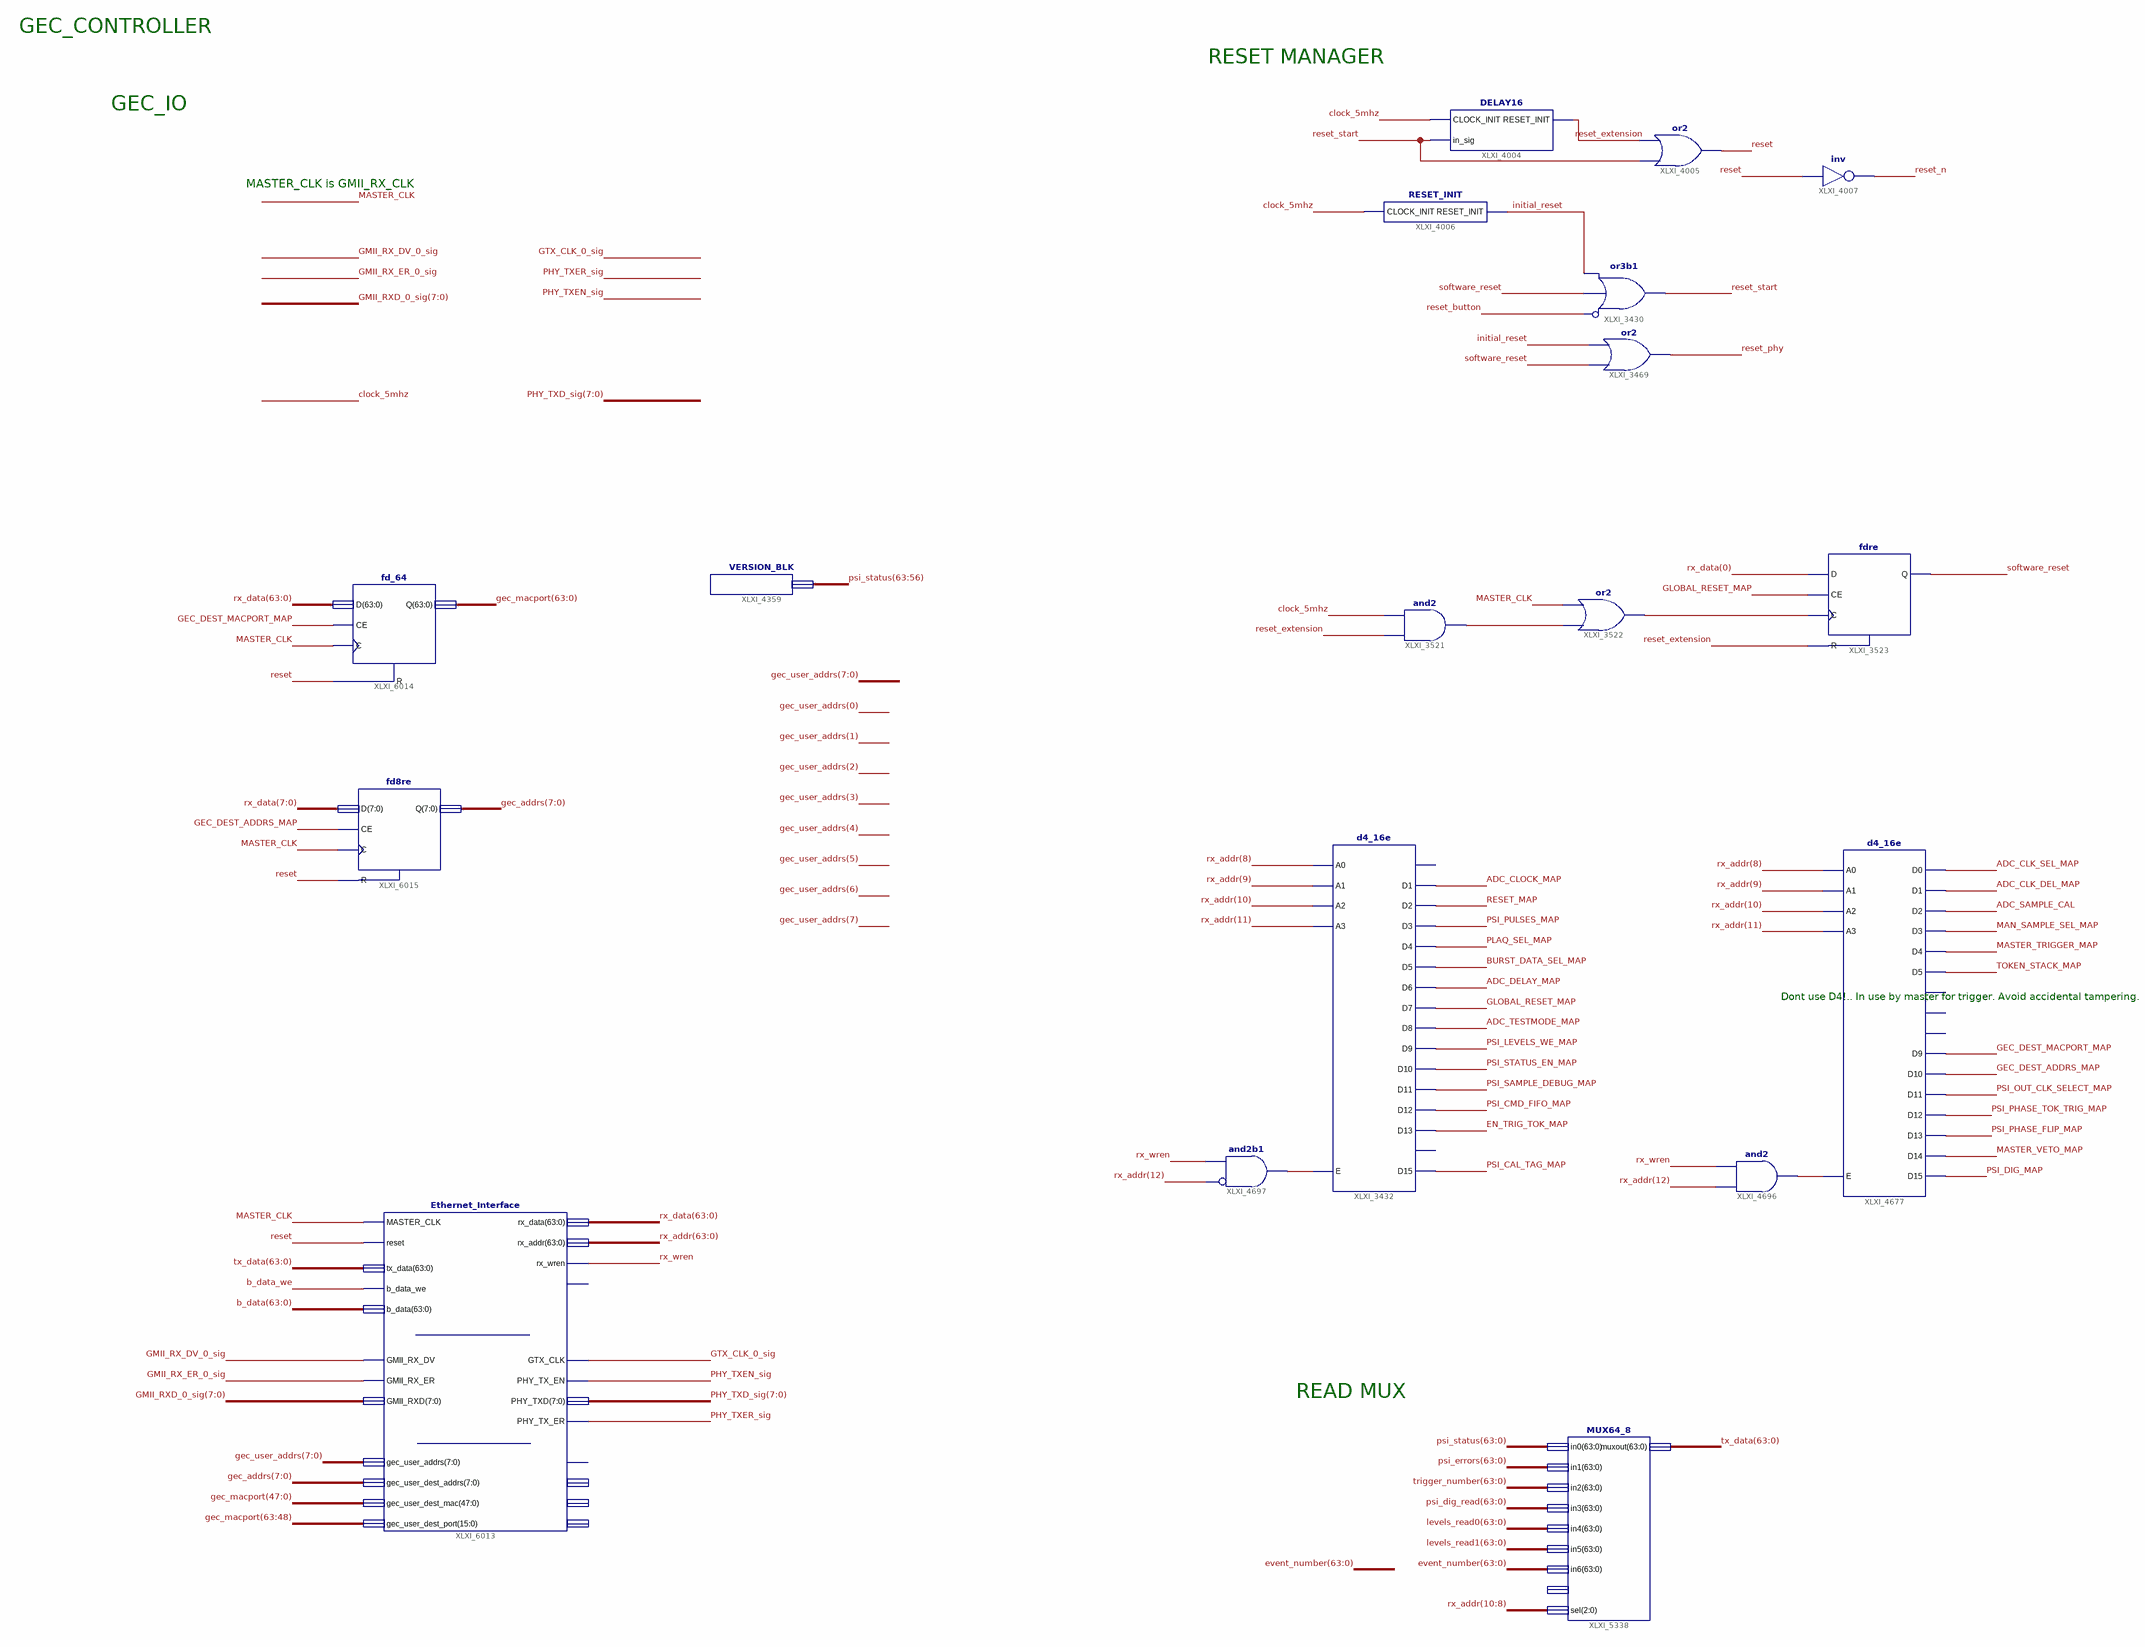
[diagram p0: schematic sheet 1]
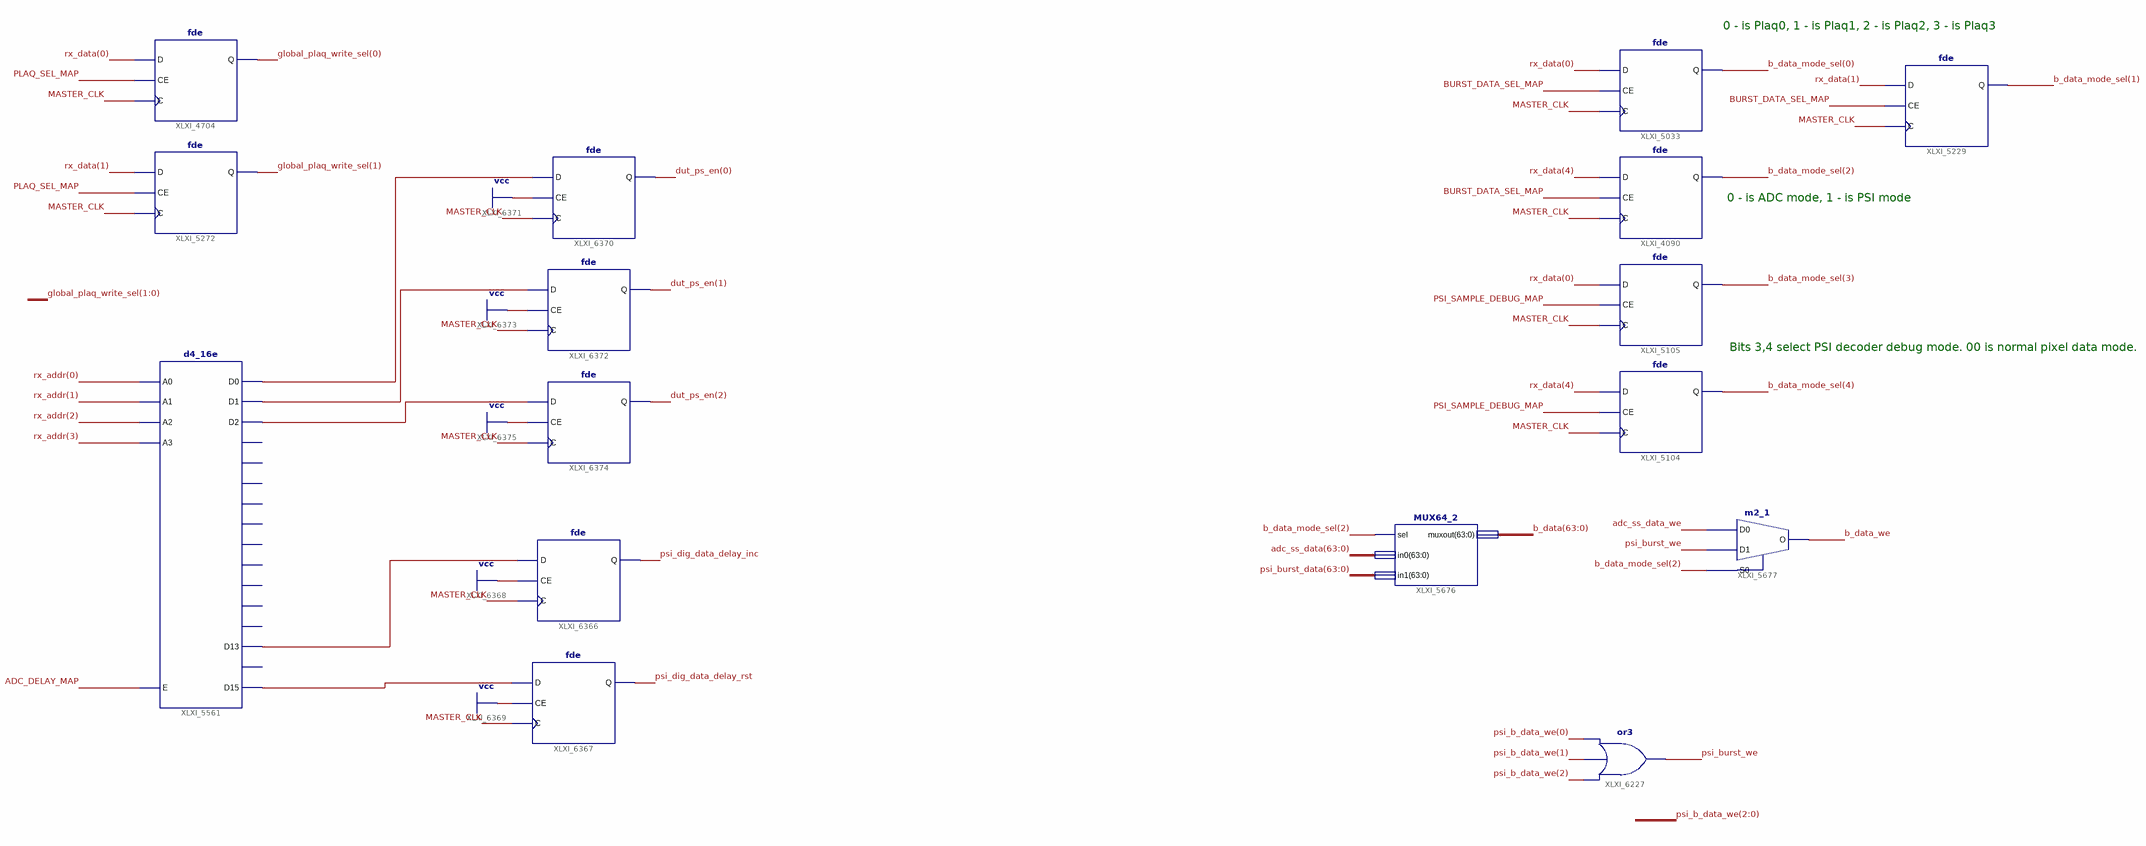
[diagram p1: schematic sheet 2]
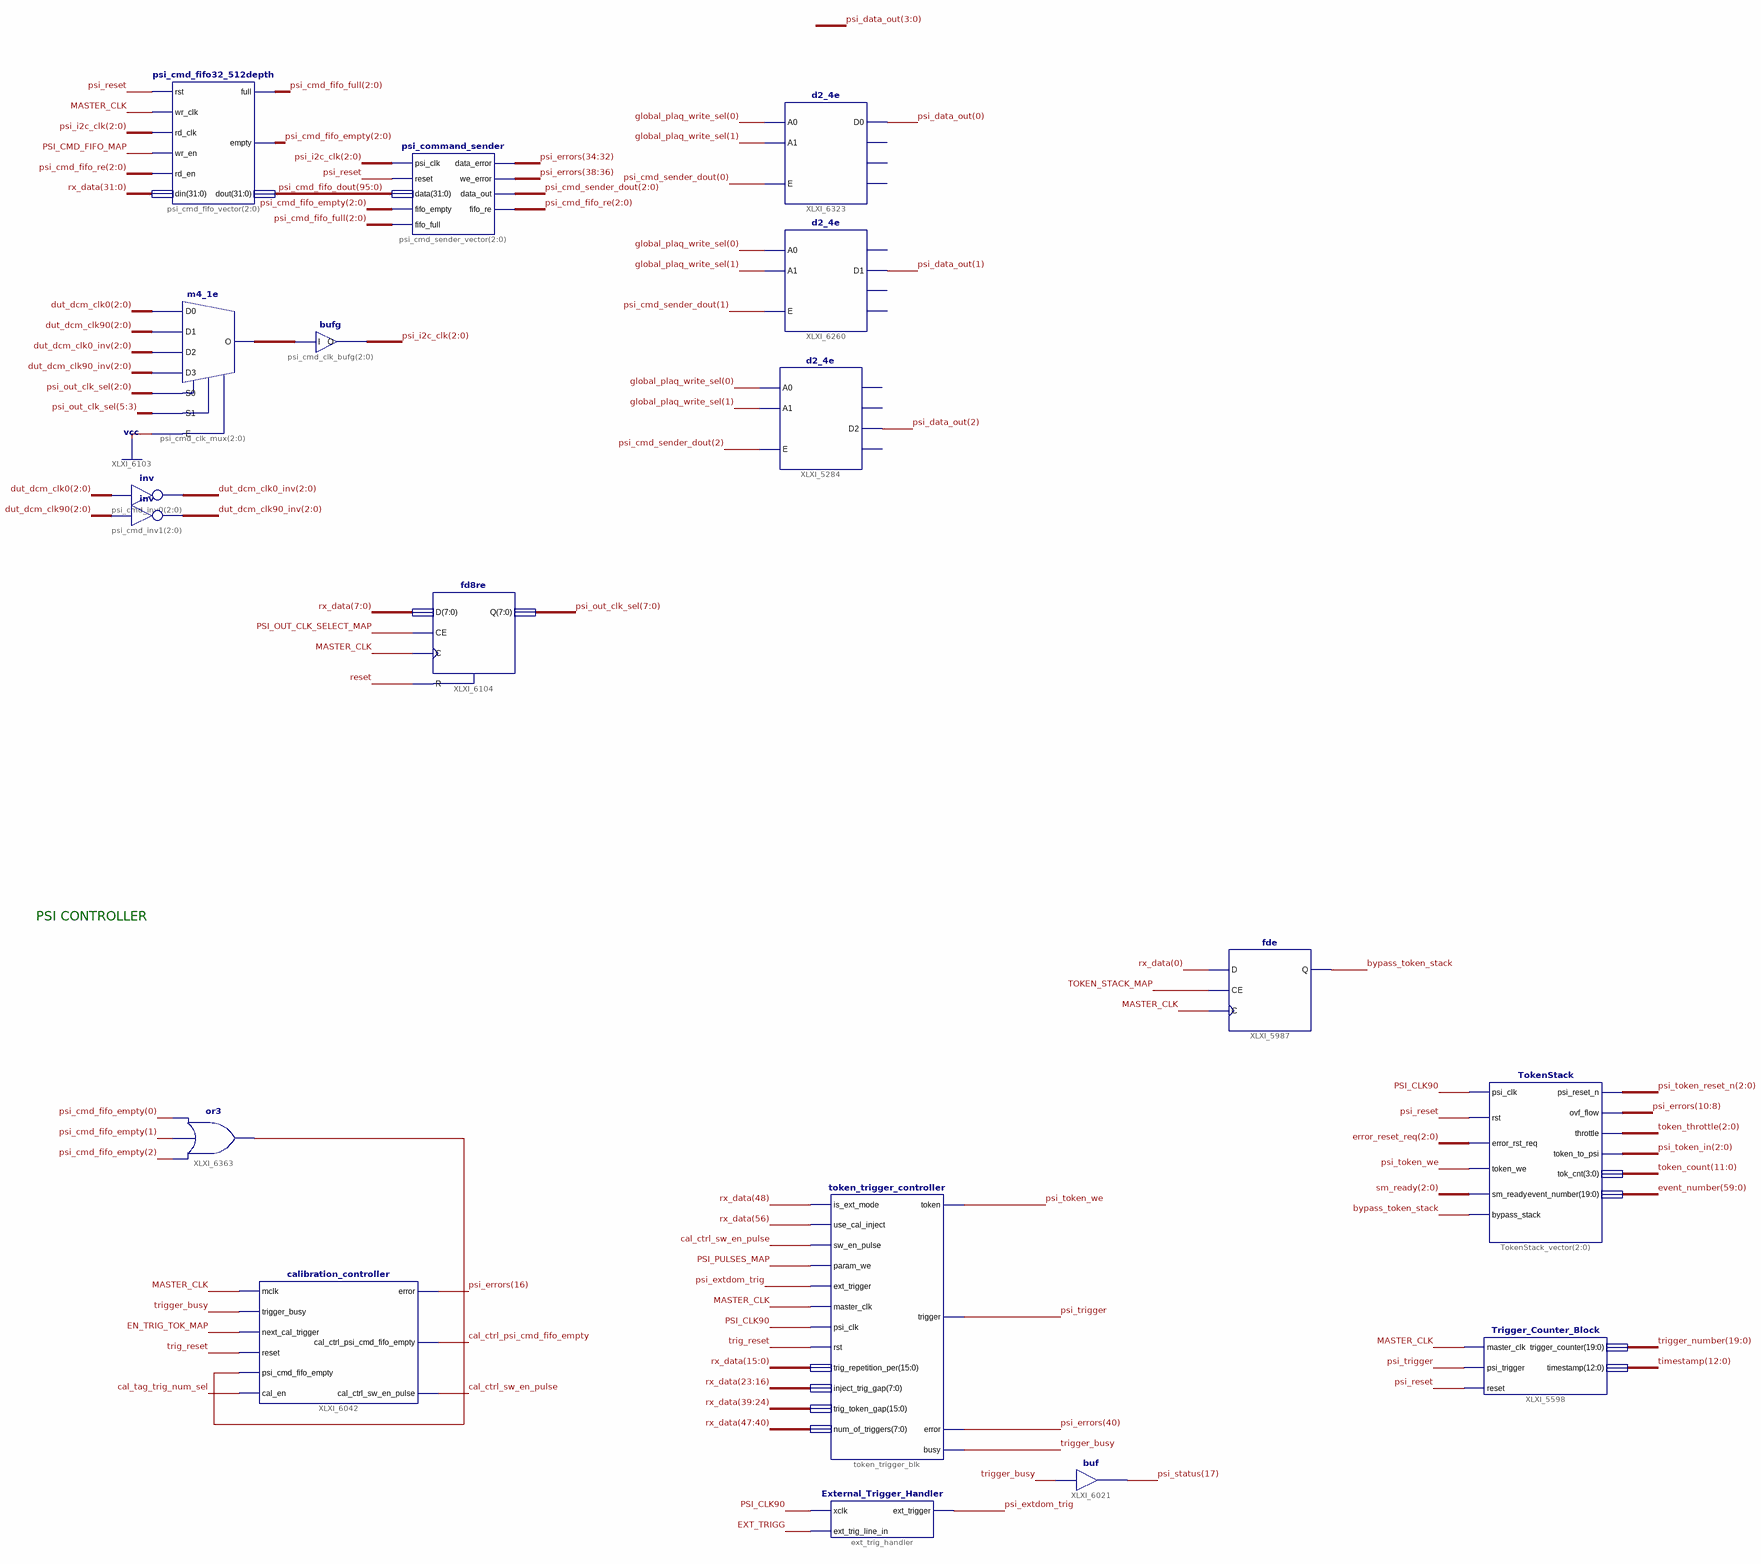
[diagram p2: schematic sheet 3]
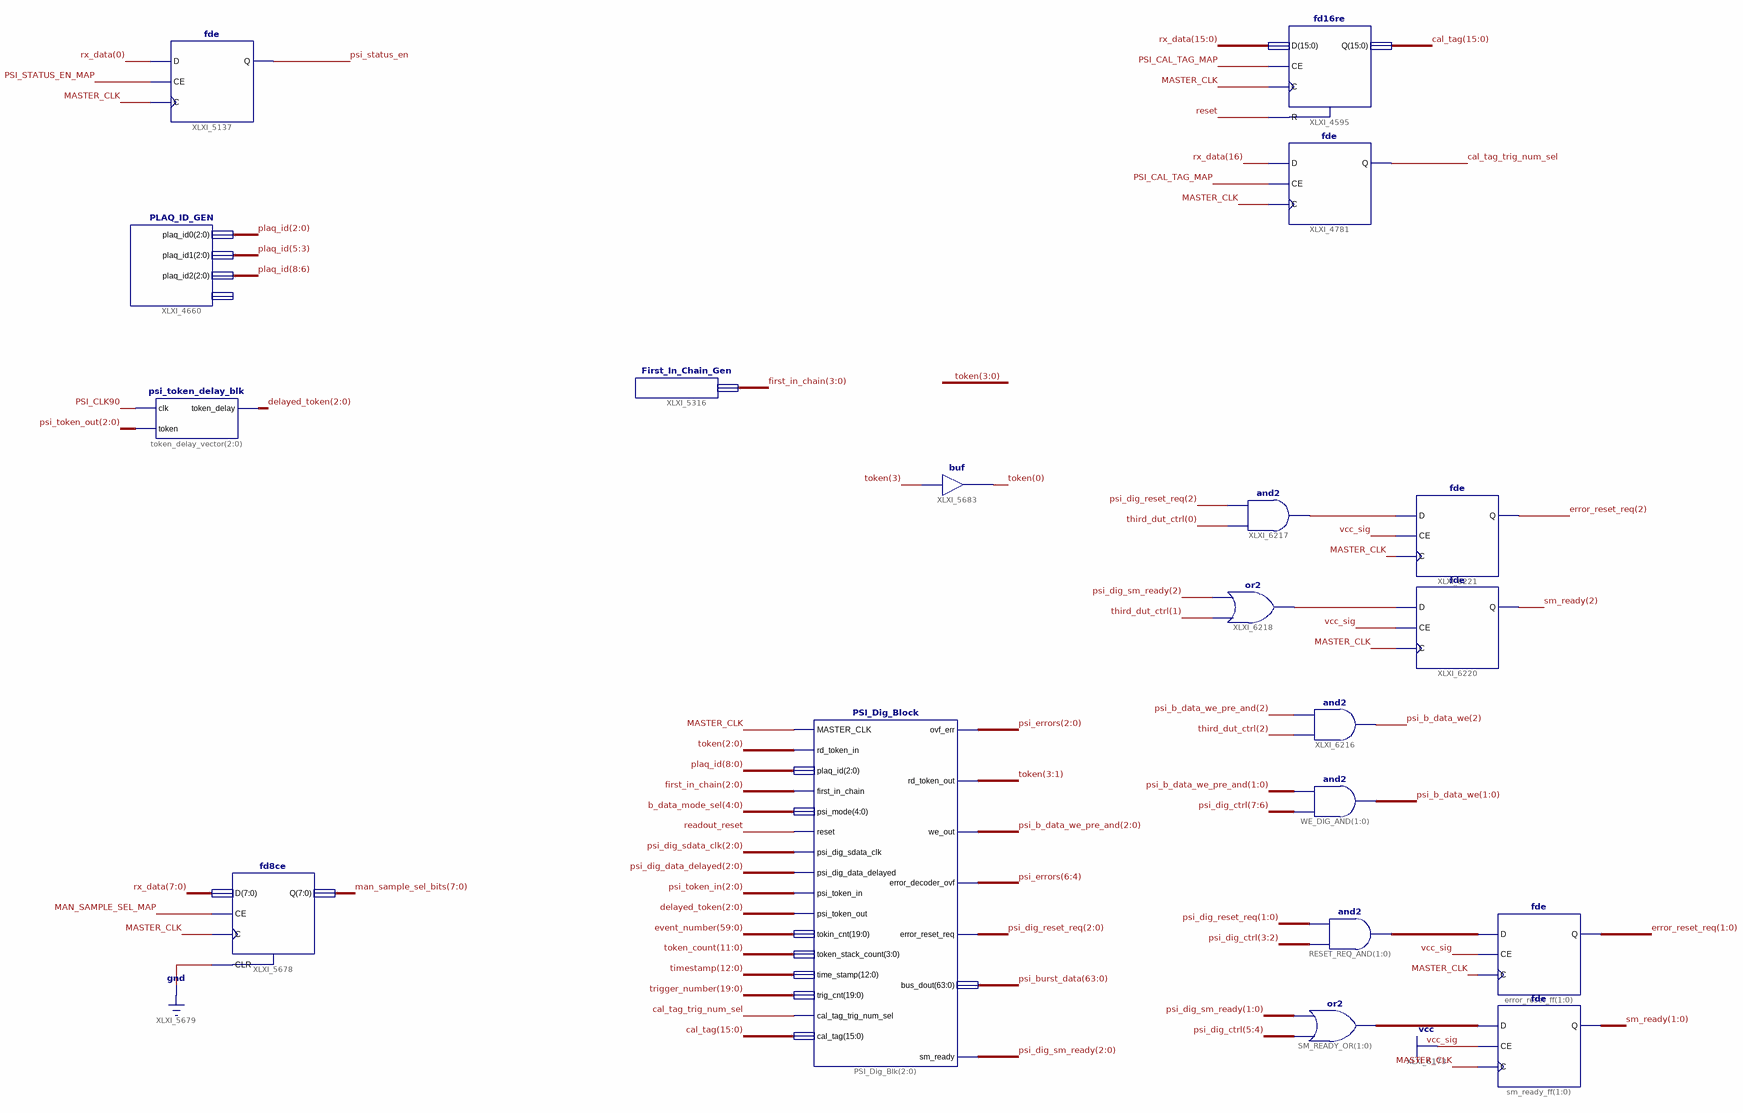
[diagram p3: schematic sheet 4]
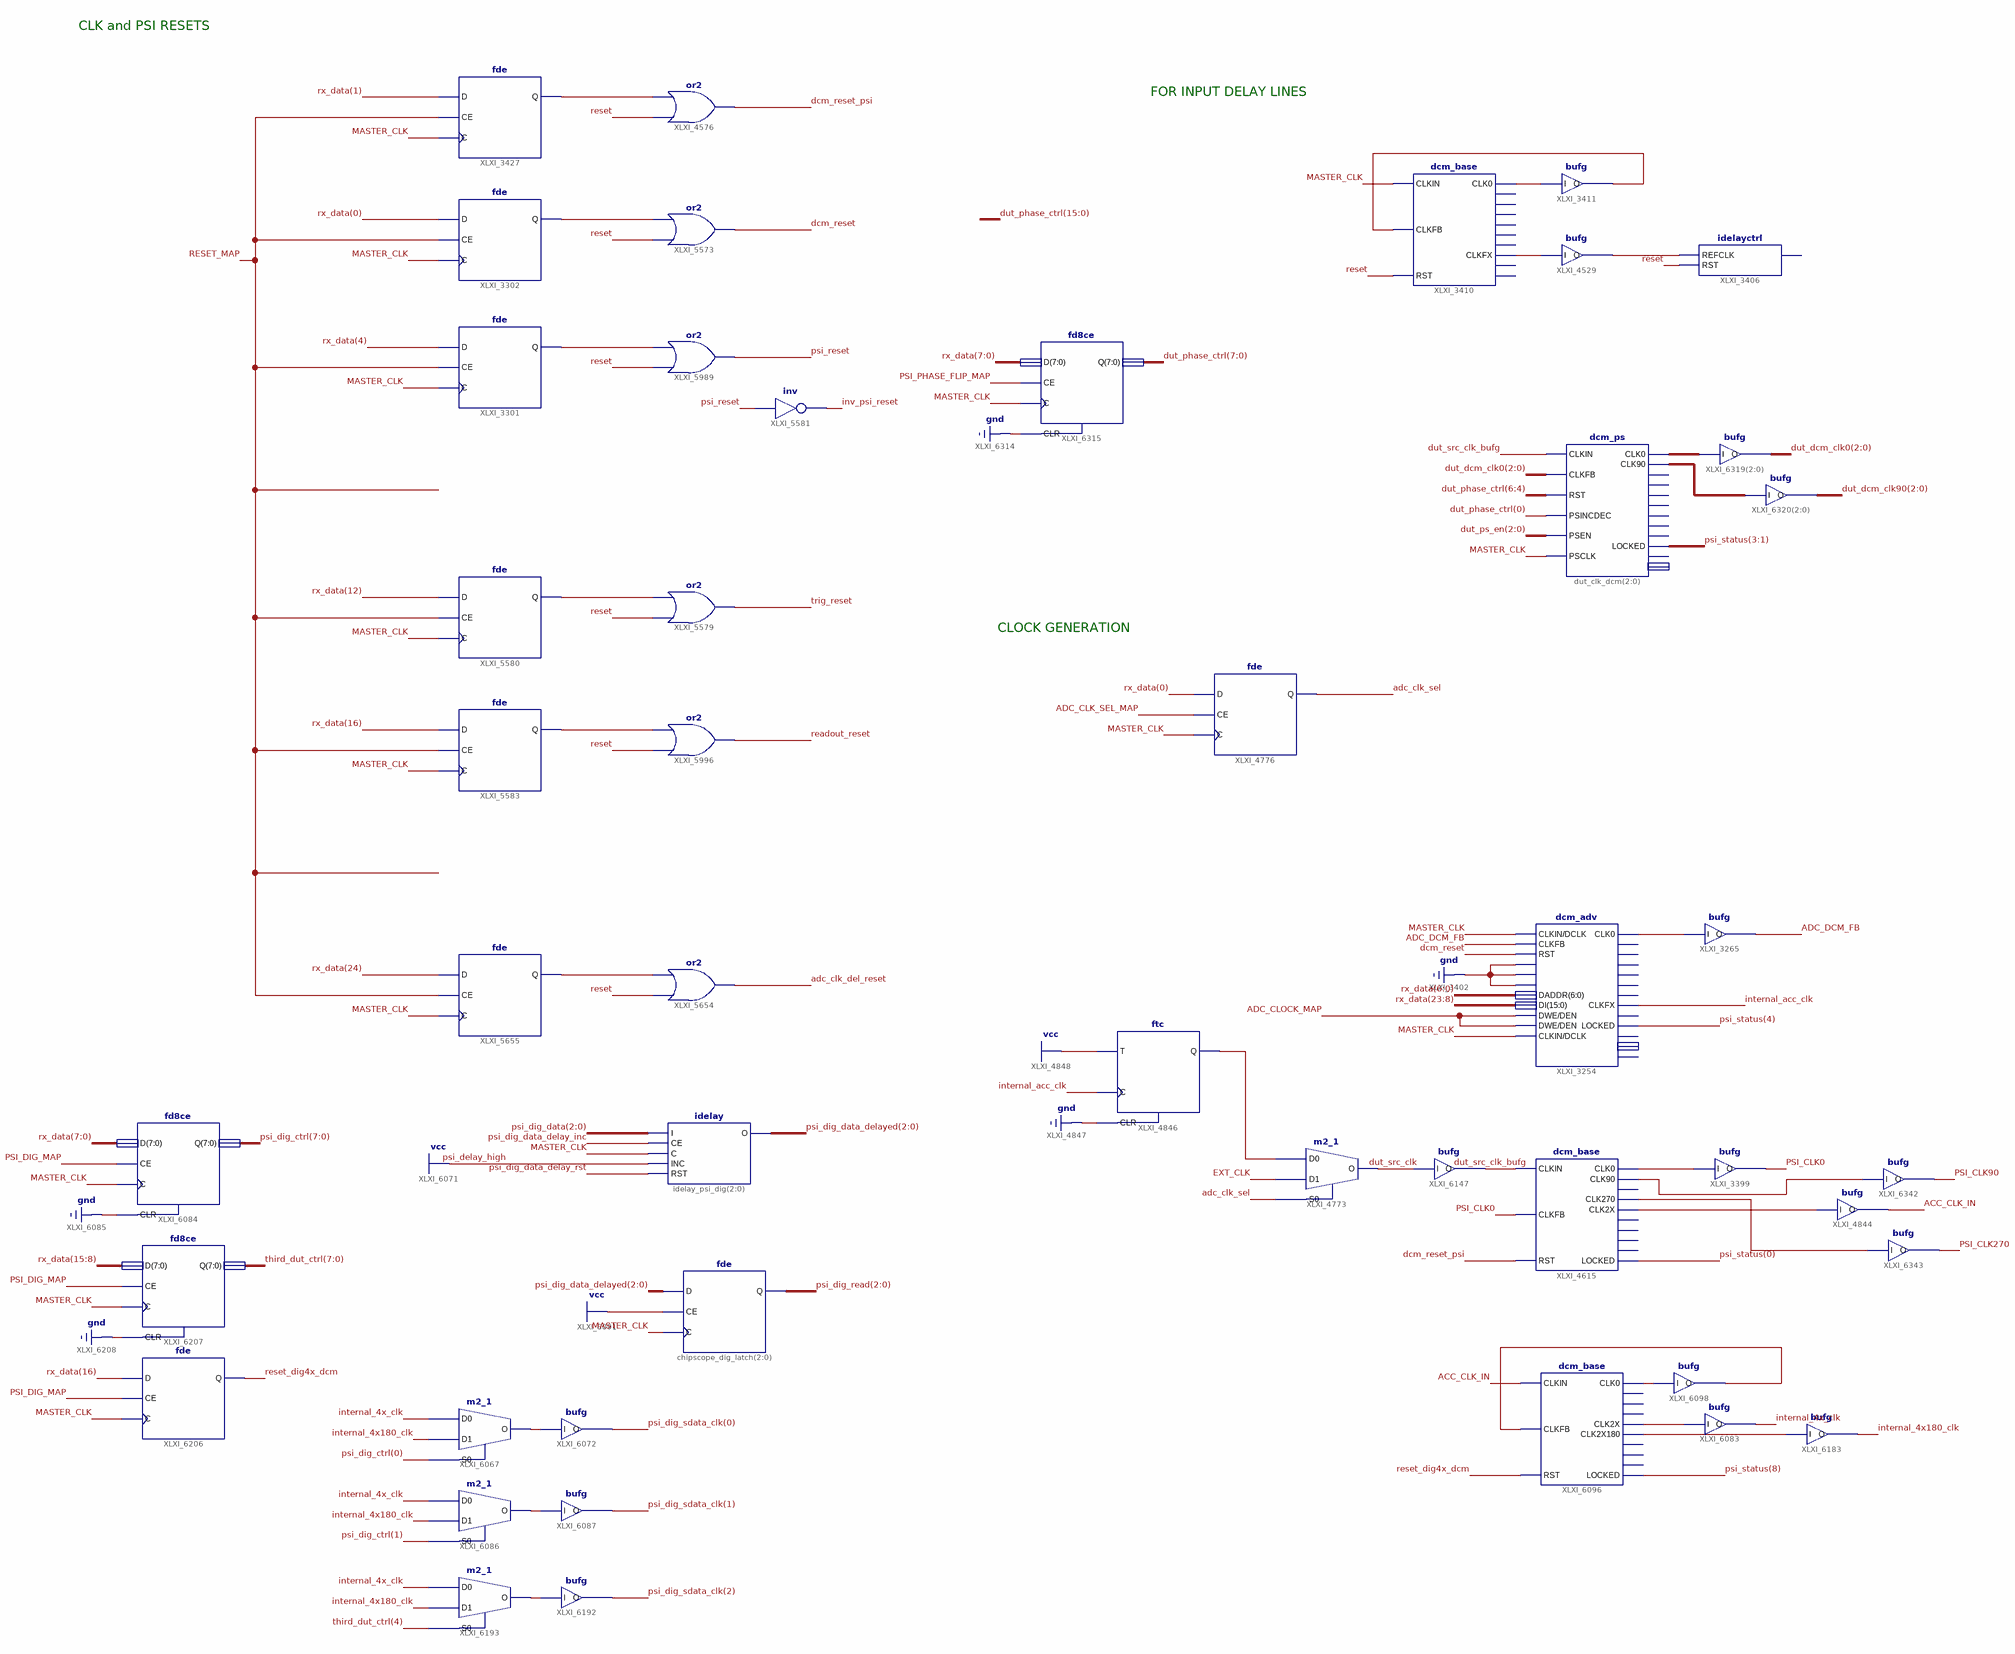
[diagram p4: schematic sheet 5]
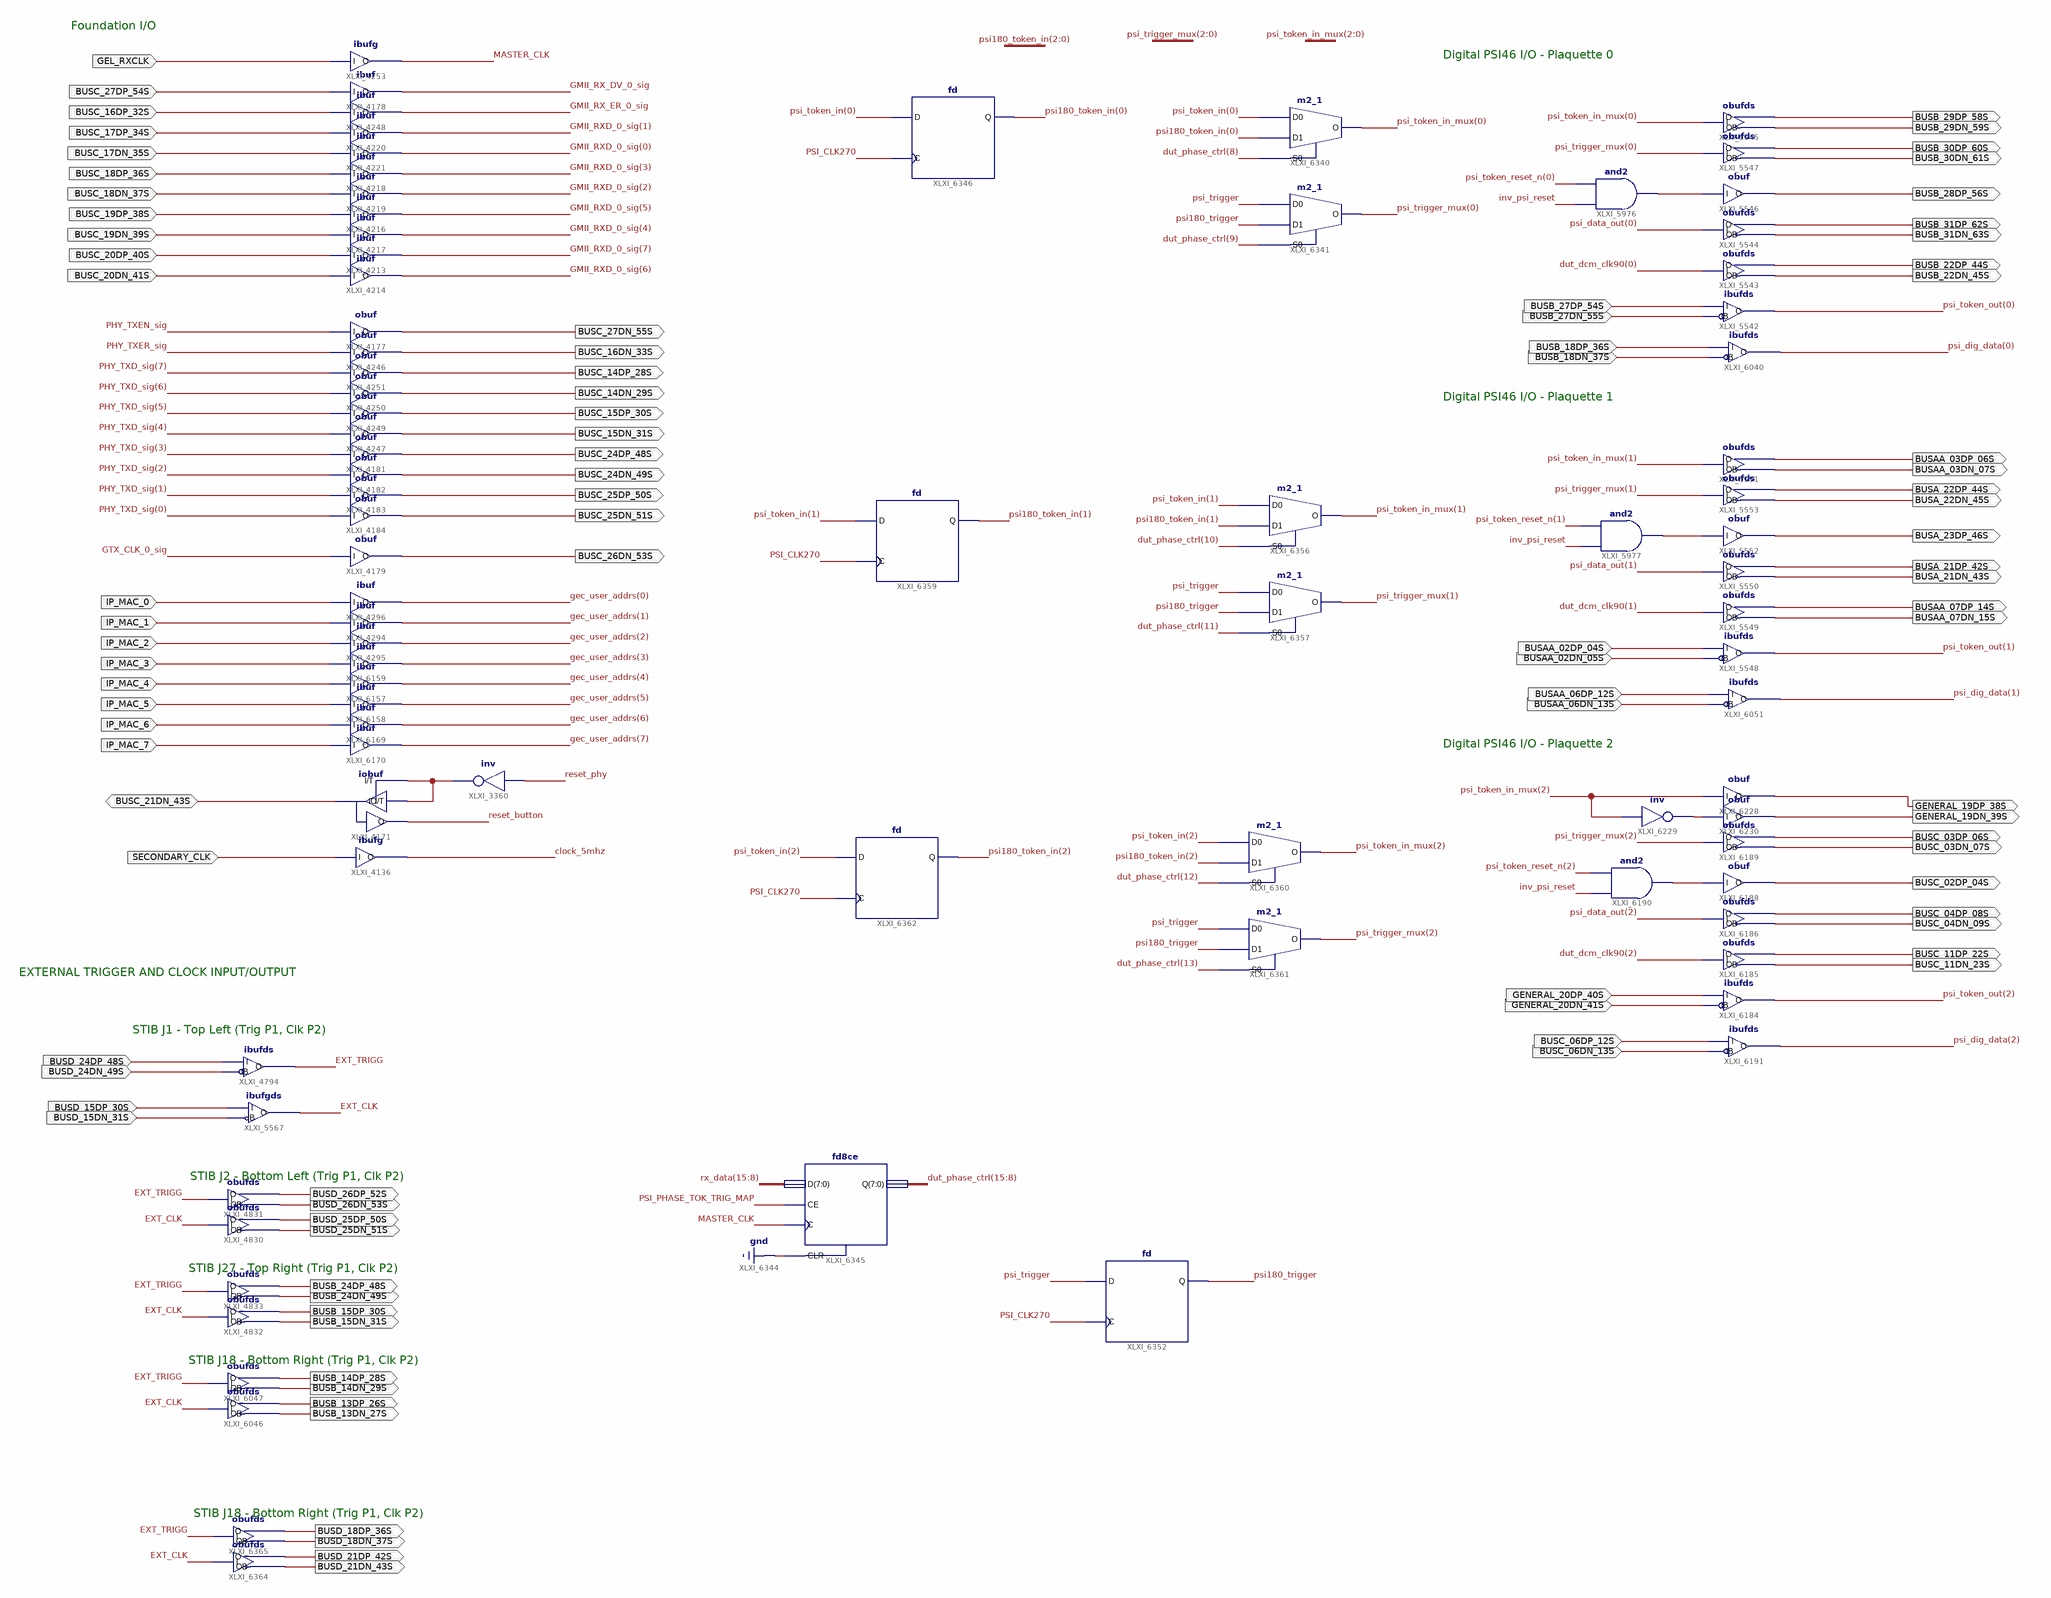
[diagram p5: schematic sheet 6]
// Xilinx ISE schematic TOP_LEVEL.sch (virtex4) as structural Verilog: 198 symbols, 91 ports
module TOP_LEVEL (
  input  BUSC_16DP_32S,
  input  SECONDARY_CLK,
  input  BUSC_20DN_41S,
  input  BUSC_19DN_39S,
  input  BUSC_20DP_40S,
  input  BUSC_19DP_38S,
  input  BUSC_18DP_36S,
  input  BUSC_18DN_37S,
  input  BUSC_17DN_35S,
  input  BUSC_17DP_34S,
  input  BUSC_27DP_54S,
  input  GEL_RXCLK,
  input  IP_MAC_2,
  input  IP_MAC_0,
  input  IP_MAC_1,
  input  BUSB_27DP_54S,
  input  BUSB_27DN_55S,
  input  BUSAA_02DP_04S,
  input  BUSAA_02DN_05S,
  input  BUSD_24DP_48S,
  input  BUSD_24DN_49S,
  input  BUSD_15DP_30S,
  input  BUSD_15DN_31S,
  input  BUSB_18DN_37S,
  input  BUSB_18DP_36S,
  input  BUSAA_06DN_13S,
  input  BUSAA_06DP_12S,
  input  IP_MAC_3,
  input  IP_MAC_4,
  input  IP_MAC_5,
  input  IP_MAC_6,
  input  IP_MAC_7,
  input  BUSC_06DP_12S,
  input  GENERAL_20DN_41S,
  input  BUSC_06DN_13S,
  input  GENERAL_20DP_40S,
  inout  BUSC_21DN_43S,
  output BUSC_25DN_51S,
  output BUSC_25DP_50S,
  output BUSC_24DN_49S,
  output BUSC_24DP_48S,
  output BUSC_15DN_31S,
  output BUSC_15DP_30S,
  output BUSC_14DN_29S,
  output BUSC_14DP_28S,
  output BUSC_16DN_33S,
  output BUSC_27DN_55S,
  output BUSC_26DN_53S,
  output BUSB_29DN_59S,
  output BUSB_31DN_63S,
  output BUSB_22DP_44S,
  output BUSB_22DN_45S,
  output BUSB_31DP_62S,
  output BUSB_28DP_56S,
  output BUSB_30DN_61S,
  output BUSAA_07DP_14S,
  output BUSAA_07DN_15S,
  output BUSA_21DP_42S,
  output BUSA_21DN_43S,
  output BUSAA_03DP_06S,
  output BUSAA_03DN_07S,
  output BUSA_23DP_46S,
  output BUSA_22DP_44S,
  output BUSA_22DN_45S,
  output BUSB_29DP_58S,
  output BUSB_30DP_60S,
  output BUSD_26DN_53S,
  output BUSD_26DP_52S,
  output BUSB_15DP_30S,
  output BUSB_15DN_31S,
  output BUSD_25DN_51S,
  output BUSD_25DP_50S,
  output BUSB_24DN_49S,
  output BUSB_24DP_48S,
  output BUSB_13DP_26S,
  output BUSB_13DN_27S,
  output BUSB_14DN_29S,
  output BUSB_14DP_28S,
  output BUSC_11DP_22S,
  output BUSC_11DN_23S,
  output BUSC_04DP_08S,
  output BUSC_04DN_09S,
  output GENERAL_19DP_38S,
  output GENERAL_19DN_39S,
  output BUSC_02DP_04S,
  output BUSC_03DP_06S,
  output BUSC_03DN_07S,
  output BUSD_21DP_42S,
  output BUSD_21DN_43S,
  output BUSD_18DP_36S,
  output BUSD_18DN_37S
);

  wire ACC_CLK_IN, ADC_CLK_DEL_MAP, adc_clk_del_reset, adc_clk_sel, ADC_CLK_SEL_MAP, ADC_CLOCK_MAP,
       ADC_DCM_FB, ADC_DELAY_MAP, ADC_SAMPLE_CAL, adc_ss_data_we, ADC_TESTMODE_MAP, b_data_we,
       BURST_DATA_SEL_MAP, bypass_token_stack, cal_ctrl_psi_cmd_fifo_empty, cal_ctrl_sw_en_pulse,
       cal_tag_trig_num_sel, clock_5mhz, dcm_reset, dcm_reset_psi, dut_src_clk, dut_src_clk_bufg,
       EN_TRIG_TOK_MAP, EXT_CLK, EXT_TRIGG, GEC_DEST_ADDRS_MAP, GEC_DEST_MACPORT_MAP, GLOBAL_RESET_MAP,
       GMII_RX_DV_0_sig, GMII_RX_ER_0_sig, GTX_CLK_0_sig, initial_reset, internal_4x180_clk, internal_4x_clk,
       internal_acc_clk, inv_psi_reset, MAN_SAMPLE_SEL_MAP, MASTER_CLK, MASTER_TRIGGER_MAP, MASTER_VETO_MAP,
       PHY_TXEN_sig, PHY_TXER_sig, PLAQ_SEL_MAP, psi180_trigger, psi_burst_we, PSI_CAL_TAG_MAP, PSI_CLK0,
       PSI_CLK90, PSI_CLK270, PSI_CMD_FIFO_MAP, psi_dig_data_delay_inc, psi_dig_data_delay_rst, PSI_DIG_MAP,
       psi_extdom_trig, PSI_LEVELS_WE_MAP, PSI_OUT_CLK_SELECT_MAP, PSI_PHASE_FLIP_MAP,
       PSI_PHASE_TOK_TRIG_MAP, PSI_PULSES_MAP, psi_reset, PSI_SAMPLE_DEBUG_MAP, psi_status_en,
       PSI_STATUS_EN_MAP, psi_token_we, psi_trigger, readout_reset, reset, reset_button, reset_dig4x_dcm,
       reset_extension, RESET_MAP, reset_n, reset_phy, reset_start, rx_wren, software_reset, TOKEN_STACK_MAP,
       trig_reset, trigger_busy, XLXN_11574, XLXN_12023, XLXN_12172, XLXN_12220, XLXN_12229, XLXN_12257,
       XLXN_12498, XLXN_12503, XLXN_12617, XLXN_15064, XLXN_15755, XLXN_17193, XLXN_17196, XLXN_17199,
       XLXN_17233, XLXN_17239, XLXN_17430, XLXN_18354, XLXN_18355, XLXN_18372, XLXN_18389, XLXN_18390,
       XLXN_18532, XLXN_18537, XLXN_18569, XLXN_18597, XLXN_18694, XLXN_18695, XLXN_18698, XLXN_18810,
       XLXN_18983, XLXN_18986, XLXN_18989, XLXN_18992, XLXN_18993, XLXN_19008, XLXN_19009, XLXN_19019,
       XLXN_19020, XLXN_19021;
  wire [1:0] global_plaq_write_sel, XLXN_18540, XLXN_18546;
  wire [2:0] delayed_token, dut_dcm_clk0, dut_dcm_clk0_inv, dut_dcm_clk90, dut_dcm_clk90_inv, dut_ps_en,
       error_reset_req, psi180_token_in, psi_b_data_we, psi_b_data_we_pre_and, psi_cmd_fifo_empty,
       psi_cmd_fifo_full, psi_cmd_fifo_re, psi_cmd_sender_dout, psi_data_out, psi_dig_data,
       psi_dig_data_delayed, psi_dig_reset_req, psi_dig_sdata_clk, psi_dig_sm_ready, psi_i2c_clk,
       psi_token_in, psi_token_in_mux, psi_token_out, psi_token_reset_n, psi_trigger_mux, sm_ready,
       token_throttle, XLXN_18856, XLXN_18857, XLXN_19101;
  wire [3:0] first_in_chain, token;
  wire [4:0] b_data_mode_sel;
  wire [7:0] gec_addrs, gec_user_addrs, GMII_RXD_0_sig, man_sample_sel_bits, PHY_TXD_sig, psi_dig_ctrl,
       psi_out_clk_sel, third_dut_ctrl;
  wire [8:0] plaq_id;
  wire [11:0] token_count;
  wire [12:0] timestamp;
  wire [15:0] cal_tag, dut_phase_ctrl;
  wire [63:0] adc_ss_data, b_data, event_number, gec_macport, levels_read0, levels_read1, psi_burst_data,
       psi_dig_read, psi_errors, psi_status, rx_addr, rx_data, trigger_number, tx_data;
  wire [95:0] psi_cmd_fifo_dout;

  ibuf XLXI_4248 (.I(BUSC_16DP_32S), .O(GMII_RX_ER_0_sig));
  ibufg XLXI_4136 (.I(SECONDARY_CLK), .O(clock_5mhz));
  obuf XLXI_4181 (.I(PHY_TXD_sig[3]), .O(BUSC_24DP_48S));
  obuf XLXI_4182 (.I(PHY_TXD_sig[2]), .O(BUSC_24DN_49S));
  obuf XLXI_4183 (.I(PHY_TXD_sig[1]), .O(BUSC_25DP_50S));
  obuf XLXI_4184 (.I(PHY_TXD_sig[0]), .O(BUSC_25DN_51S));
  obuf XLXI_4247 (.I(PHY_TXD_sig[4]), .O(BUSC_15DN_31S));
  obuf XLXI_4249 (.I(PHY_TXD_sig[5]), .O(BUSC_15DP_30S));
  obuf XLXI_4250 (.I(PHY_TXD_sig[6]), .O(BUSC_14DN_29S));
  obuf XLXI_4251 (.I(PHY_TXD_sig[7]), .O(BUSC_14DP_28S));
  obuf XLXI_4246 (.I(PHY_TXER_sig), .O(BUSC_16DN_33S));
  ibuf XLXI_4213 (.I(BUSC_20DP_40S), .O(GMII_RXD_0_sig[7]));
  ibuf XLXI_4214 (.I(BUSC_20DN_41S), .O(GMII_RXD_0_sig[6]));
  ibuf XLXI_4216 (.I(BUSC_19DP_38S), .O(GMII_RXD_0_sig[5]));
  ibuf XLXI_4217 (.I(BUSC_19DN_39S), .O(GMII_RXD_0_sig[4]));
  ibuf XLXI_4218 (.I(BUSC_18DP_36S), .O(GMII_RXD_0_sig[3]));
  ibuf XLXI_4219 (.I(BUSC_18DN_37S), .O(GMII_RXD_0_sig[2]));
  ibuf XLXI_4220 (.I(BUSC_17DP_34S), .O(GMII_RXD_0_sig[1]));
  ibuf XLXI_4221 (.I(BUSC_17DN_35S), .O(GMII_RXD_0_sig[0]));
  obuf XLXI_4177 (.I(PHY_TXEN_sig), .O(BUSC_27DN_55S));
  ibuf XLXI_4178 (.I(BUSC_27DP_54S), .O(GMII_RX_DV_0_sig));
  ibufg XLXI_4253 (.I(GEL_RXCLK), .O(MASTER_CLK));
  obuf XLXI_4179 (.I(GTX_CLK_0_sig), .O(BUSC_26DN_53S));
  ibuf XLXI_4294 (.I(IP_MAC_1), .O(gec_user_addrs[1]));
  ibuf XLXI_4295 (.I(IP_MAC_2), .O(gec_user_addrs[2]));
  ibuf XLXI_4296 (.I(IP_MAC_0), .O(gec_user_addrs[0]));
  RESET_INIT XLXI_4006 (.CLOCK_INIT(clock_5mhz), .RESET_INIT(initial_reset));
  or XLXI_3430 (reset_start, ~reset_button, software_reset, initial_reset);  // or3b1
  or XLXI_3469 (reset_phy, software_reset, initial_reset);
  DELAY16 XLXI_4004 (.CLOCK_INIT(clock_5mhz), .in_sig(reset_start), .RESET_INIT(reset_extension));
  or XLXI_4005 (reset, reset_start, reset_extension);
  fdre XLXI_3523 (.C(XLXN_12498), .CE(GLOBAL_RESET_MAP), .D(rx_data[0]), .R(reset_extension), .Q(software_reset));
  and XLXI_3521 (XLXN_12503, reset_extension, clock_5mhz);
  or XLXI_3522 (XLXN_12498, XLXN_12503, MASTER_CLK);
  d4_16e XLXI_3432 (
    .A0(rx_addr[8]), .A1(rx_addr[9]), .A2(rx_addr[10]), .A3(rx_addr[11]), .E(XLXN_12617), .D1(ADC_CLOCK_MAP),
    .D10(PSI_STATUS_EN_MAP), .D11(PSI_SAMPLE_DEBUG_MAP), .D12(PSI_CMD_FIFO_MAP), .D13(EN_TRIG_TOK_MAP),
    .D15(PSI_CAL_TAG_MAP), .D2(RESET_MAP), .D3(PSI_PULSES_MAP), .D4(PLAQ_SEL_MAP), .D5(BURST_DATA_SEL_MAP),
    .D6(ADC_DELAY_MAP), .D7(GLOBAL_RESET_MAP), .D8(ADC_TESTMODE_MAP), .D9(PSI_LEVELS_WE_MAP));  // open: D0, D14
  and XLXI_4697 (XLXN_12617, ~rx_addr[12], rx_wren);  // and2b1
  fde XLXI_3302 (.C(MASTER_CLK), .CE(RESET_MAP), .D(rx_data[0]), .Q(XLXN_17196));
  fde XLXI_3427 (.C(MASTER_CLK), .CE(RESET_MAP), .D(rx_data[1]), .Q(XLXN_17193));
  fde XLXI_3301 (.C(MASTER_CLK), .CE(RESET_MAP), .D(rx_data[4]), .Q(XLXN_17199));
  and XLXI_4696 (XLXN_15755, rx_addr[12], rx_wren);
  d4_16e XLXI_4677 (
    .A0(rx_addr[8]), .A1(rx_addr[9]), .A2(rx_addr[10]), .A3(rx_addr[11]), .E(XLXN_15755),
    .D0(ADC_CLK_SEL_MAP), .D1(ADC_CLK_DEL_MAP), .D10(GEC_DEST_ADDRS_MAP), .D11(PSI_OUT_CLK_SELECT_MAP),
    .D12(PSI_PHASE_TOK_TRIG_MAP), .D13(PSI_PHASE_FLIP_MAP), .D14(MASTER_VETO_MAP), .D15(PSI_DIG_MAP),
    .D2(ADC_SAMPLE_CAL), .D3(MAN_SAMPLE_SEL_MAP), .D4(MASTER_TRIGGER_MAP), .D5(TOKEN_STACK_MAP),
    .D9(GEC_DEST_MACPORT_MAP));  // open: D6, D7, D8
  fde XLXI_4090 (.C(MASTER_CLK), .CE(BURST_DATA_SEL_MAP), .D(rx_data[4]), .Q(b_data_mode_sel[2]));
  fde XLXI_5033 (.C(MASTER_CLK), .CE(BURST_DATA_SEL_MAP), .D(rx_data[0]), .Q(b_data_mode_sel[0]));
  fde XLXI_5104 (.C(MASTER_CLK), .CE(PSI_SAMPLE_DEBUG_MAP), .D(rx_data[4]), .Q(b_data_mode_sel[4]));
  fde XLXI_5105 (.C(MASTER_CLK), .CE(PSI_SAMPLE_DEBUG_MAP), .D(rx_data[0]), .Q(b_data_mode_sel[3]));
  not XLXI_4007 (reset_n, reset);
  fde XLXI_5229 (.C(MASTER_CLK), .CE(BURST_DATA_SEL_MAP), .D(rx_data[1]), .Q(b_data_mode_sel[1]));
  fde XLXI_5272 (.C(MASTER_CLK), .CE(PLAQ_SEL_MAP), .D(rx_data[1]), .Q(global_plaq_write_sel[1]));
  fde XLXI_4704 (.C(MASTER_CLK), .CE(PLAQ_SEL_MAP), .D(rx_data[0]), .Q(global_plaq_write_sel[0]));
  PLAQ_ID_GEN XLXI_4660 (.plaq_id0(plaq_id[2:0]), .plaq_id1(plaq_id[5:3]), .plaq_id2(plaq_id[8:6]));  // open: plaq_id3
  fde XLXI_5137 (.C(MASTER_CLK), .CE(PSI_STATUS_EN_MAP), .D(rx_data[0]), .Q(psi_status_en));
  psi_token_delay_blk token_delay_vector[2:0] (.clk(PSI_CLK90), .token(psi_token_out), .token_delay(delayed_token));
  First_In_Chain_Gen XLXI_5316 (.first_in_chain(first_in_chain));
  fd16re XLXI_4595 (.C(MASTER_CLK), .CE(PSI_CAL_TAG_MAP), .D(rx_data[15:0]), .R(reset), .Q(cal_tag));
  fde XLXI_4781 (.C(MASTER_CLK), .CE(PSI_CAL_TAG_MAP), .D(rx_data[16]), .Q(cal_tag_trig_num_sel));
  MUX64_8 XLXI_5338 (
    .in0(psi_status), .in1(psi_errors), .in2(trigger_number), .in3(psi_dig_read), .in4(levels_read0),
    .in5(levels_read1), .in6(event_number), .sel(rx_addr[10:8]), .muxout(tx_data));  // open: in7
  d4_16e XLXI_5561 (
    .A0(rx_addr[0]), .A1(rx_addr[1]), .A2(rx_addr[2]), .A3(rx_addr[3]), .E(ADC_DELAY_MAP), .D0(XLXN_19019),
    .D1(XLXN_19020), .D13(XLXN_19008), .D15(XLXN_19009), .D2(XLXN_19021));  // open: D10, D11, D12, D14, D3, D4, D5, D6, D7, D8, D9
  token_trigger_controller token_trigger_blk (
    .is_ext_mode(rx_data[48]), .use_cal_inject(rx_data[56]), .sw_en_pulse(cal_ctrl_sw_en_pulse),
    .param_we(PSI_PULSES_MAP), .ext_trigger(psi_extdom_trig), .master_clk(MASTER_CLK), .psi_clk(PSI_CLK90),
    .rst(trig_reset), .trig_repetition_per(rx_data[15:0]), .inject_trig_gap(rx_data[23:16]),
    .trig_token_gap(rx_data[39:24]), .num_of_triggers(rx_data[47:40]), .token(psi_token_we),
    .trigger(psi_trigger), .error(psi_errors[40]), .busy(trigger_busy));
  or XLXI_4576 (dcm_reset_psi, reset, XLXN_17193);
  or XLXI_5573 (dcm_reset, reset, XLXN_17196);
  or XLXI_5579 (trig_reset, reset, XLXN_17233);
  fde XLXI_5580 (.C(MASTER_CLK), .CE(RESET_MAP), .D(rx_data[12]), .Q(XLXN_17233));
  not XLXI_5581 (inv_psi_reset, psi_reset);
  fde XLXI_5583 (.C(MASTER_CLK), .CE(RESET_MAP), .D(rx_data[16]), .Q(XLXN_17239));
  or XLXI_5654 (adc_clk_del_reset, reset, XLXN_17430);
  fde XLXI_5655 (.C(MASTER_CLK), .CE(RESET_MAP), .D(rx_data[24]), .Q(XLXN_17430));
  MUX64_2 XLXI_5676 (.sel(b_data_mode_sel[2]), .in0(adc_ss_data), .in1(psi_burst_data), .muxout(b_data));
  m2_1 XLXI_5677 (.D0(adc_ss_data_we), .D1(psi_burst_we), .S0(b_data_mode_sel[2]), .O(b_data_we));
  fd8ce XLXI_5678 (.C(MASTER_CLK), .CE(MAN_SAMPLE_SEL_MAP), .CLR(1'b0), .D(rx_data[7:0]), .Q(man_sample_sel_bits));
  dcm_base #(.CLKIN_PERIOD(8), .CLKFX_MULTIPLY(8), .CLKFX_DIVIDE(5)) XLXI_3410 (
    .CLKIN(MASTER_CLK), .CLKFB(XLXN_12229), .RST(reset), .CLK0(XLXN_12220), .CLKFX(XLXN_12257));  // open: CLK90, CLK180, CLK270, CLK2X, CLK2X180, CLKDV, CLKFX180, LOCKED
  bufg XLXI_3411 (.I(XLXN_12220), .O(XLXN_12229));
  idelayctrl XLXI_3406 (.REFCLK(XLXN_15064), .RST(reset));  // open: RDY
  bufg XLXI_4529 (.I(XLXN_12257), .O(XLXN_15064));
  ibufds #(.DIFF_TERM("TRUE")) XLXI_5542 (.I(BUSB_27DP_54S), .IB(BUSB_27DN_55S), .O(psi_token_out[0]));
  obufds XLXI_5543 (.I(dut_dcm_clk90[0]), .O(BUSB_22DP_44S), .OB(BUSB_22DN_45S));
  obufds #(.CAPACITANCE("DONT_CARE")) XLXI_5544 (.I(psi_data_out[0]), .O(BUSB_31DP_62S), .OB(BUSB_31DN_63S));
  obufds XLXI_5545 (.I(psi_token_in_mux[0]), .O(BUSB_29DP_58S), .OB(BUSB_29DN_59S));
  obuf XLXI_5546 (.I(XLXN_18983), .O(BUSB_28DP_56S));
  obufds XLXI_5547 (.I(psi_trigger_mux[0]), .O(BUSB_30DP_60S), .OB(BUSB_30DN_61S));
  ibufds #(.DIFF_TERM("TRUE")) XLXI_5548 (.I(BUSAA_02DP_04S), .IB(BUSAA_02DN_05S), .O(psi_token_out[1]));
  obufds XLXI_5549 (.I(dut_dcm_clk90[1]), .O(BUSAA_07DP_14S), .OB(BUSAA_07DN_15S));
  obufds XLXI_5550 (.I(psi_data_out[1]), .O(BUSA_21DP_42S), .OB(BUSA_21DN_43S));
  obufds XLXI_5551 (.I(psi_token_in_mux[1]), .O(BUSAA_03DP_06S), .OB(BUSAA_03DN_07S));
  obuf XLXI_5552 (.I(XLXN_18986), .O(BUSA_23DP_46S));
  obufds XLXI_5553 (.I(psi_trigger_mux[1]), .O(BUSA_22DP_44S), .OB(BUSA_22DN_45S));
  fde XLXI_4776 (.C(MASTER_CLK), .CE(ADC_CLK_SEL_MAP), .D(rx_data[0]), .Q(adc_clk_sel));
  bufg XLXI_3265 (.I(XLXN_11574), .O(ADC_DCM_FB));
  dcm_adv #(.CLKFX_MULTIPLY(16), .CLKFX_DIVIDE(27), .DLL_FREQUENCY_MODE("LOW"), .DFS_FREQUENCY_MODE("LOW"), .CLKIN_PERIOD(8), .CLKOUT_PHASE_SHIFT("NONE")) XLXI_3254 (
    .CLKIN(MASTER_CLK), .CLKFB(ADC_DCM_FB), .RST(dcm_reset), .PSINCDEC(1'b0), .PSEN(1'b0), .PSCLK(1'b0),
    .DADDR(rx_data[6:0]), .DI(rx_data[23:8]), .DWE(ADC_CLOCK_MAP), .DEN(ADC_CLOCK_MAP), .DCLK(MASTER_CLK),
    .CLK0(XLXN_11574), .CLKFX(internal_acc_clk), .LOCKED(psi_status[4]));  // open: CLK90, CLK180, CLK270, CLK2X, CLK2X180, CLKDV, CLKFX180, PSDONE, DO, DRDY
  bufg XLXI_3399 (.I(XLXN_12172), .O(PSI_CLK0));
  dcm_base #(.CLKIN_PERIOD(26), .CLKFX_MULTIPLY(2), .CLKFX_DIVIDE(2), .DCM_PERFORMANCE_MODE("MAX_RANGE"), .CLKIN_DIVIDE_BY_2("FALSE"), .CLK_FEEDBACK("1X")) XLXI_4615 (
    .CLKIN(dut_src_clk_bufg), .CLKFB(PSI_CLK0), .RST(dcm_reset_psi), .CLK0(XLXN_12172), .CLK90(XLXN_18993),
    .CLK270(XLXN_18992), .CLK2X(XLXN_18537), .LOCKED(psi_status[0]));  // open: CLK180, CLK2X180, CLKDV, CLKFX, CLKFX180
  External_Trigger_Handler ext_trig_handler (
    .xclk(PSI_CLK90), .ext_trig_line_in(EXT_TRIGG), .ext_trigger(psi_extdom_trig));
  TokenStack TokenStack_vector[2:0] (
    .psi_clk(PSI_CLK90), .rst(psi_reset), .error_rst_req(error_reset_req), .token_we(psi_token_we),
    .sm_ready(sm_ready), .bypass_stack(bypass_token_stack), .psi_reset_n(psi_token_reset_n),
    .ovf_flow(psi_errors[10:8]), .throttle(token_throttle), .token_to_psi(psi_token_in),
    .tok_cnt(token_count), .event_number(event_number[59:0]));
  Trigger_Counter_Block XLXI_5598 (
    .master_clk(MASTER_CLK), .psi_trigger(psi_trigger), .reset(psi_reset),
    .trigger_counter(trigger_number[19:0]), .timestamp(timestamp));
  fde XLXI_5987 (.C(MASTER_CLK), .CE(TOKEN_STACK_MAP), .D(rx_data[0]), .Q(bypass_token_stack));
  or XLXI_5989 (psi_reset, reset, XLXN_17199);
  or XLXI_5996 (readout_reset, reset, XLXN_17239);
  VERSION_BLK XLXI_4359 (.version(psi_status[63:56]));
  Ethernet_Interface XLXI_6013 (
    .MASTER_CLK(MASTER_CLK), .reset(reset), .b_data_we(b_data_we), .b_data(b_data), .tx_data(tx_data),
    .GMII_RX_DV(GMII_RX_DV_0_sig), .GMII_RX_ER(GMII_RX_ER_0_sig), .GMII_RXD(GMII_RXD_0_sig),
    .gec_user_addrs(gec_user_addrs), .gec_user_dest_addrs(gec_addrs), .gec_user_dest_mac(gec_macport[47:0]),
    .gec_user_dest_port(gec_macport[63:48]), .rx_data(rx_data), .rx_addr(rx_addr), .rx_wren(rx_wren),
    .GTX_CLK(GTX_CLK_0_sig), .PHY_TX_EN(PHY_TXEN_sig), .PHY_TXD(PHY_TXD_sig), .PHY_TX_ER(PHY_TXER_sig));  // open: b_enable, gec_user_src_capture, gec_user_src_addrs, gec_user_src_mac, gec_user_src_port
  fd_64 XLXI_6014 (.Q(gec_macport), .CE(GEC_DEST_MACPORT_MAP), .D(rx_data), .C(MASTER_CLK), .R(reset));
  fd8re XLXI_6015 (.C(MASTER_CLK), .CE(GEC_DEST_ADDRS_MAP), .D(rx_data[7:0]), .R(reset), .Q(gec_addrs));
  buf XLXI_6021 (psi_status[17], trigger_busy);
  calibration_controller XLXI_6042 (
    .mclk(MASTER_CLK), .trigger_busy(trigger_busy), .next_cal_trigger(EN_TRIG_TOK_MAP), .reset(trig_reset),
    .psi_cmd_fifo_empty(XLXN_18810), .cal_en(cal_tag_trig_num_sel), .error(psi_errors[16]),
    .cal_ctrl_psi_cmd_fifo_empty(cal_ctrl_psi_cmd_fifo_empty), .cal_ctrl_sw_en_pulse(cal_ctrl_sw_en_pulse));
  buf XLXI_5683 (token[0], token[3]);
  idelay #(.IOBDELAY_TYPE("VARIABLE")) idelay_psi_dig[2:0] (
    .I(psi_dig_data), .CE(psi_dig_data_delay_inc), .C(MASTER_CLK), .INC(1'b1), .RST(psi_dig_data_delay_rst),
    .O(psi_dig_data_delayed));
  fde chipscope_dig_latch[2:0] (.C(MASTER_CLK), .CE(1'b1), .D(psi_dig_data_delayed), .Q(psi_dig_read[2:0]));
  PSI_Dig_Block PSI_Dig_Blk[2:0] (
    .MASTER_CLK(MASTER_CLK), .rd_token_in(token[2:0]), .plaq_id(plaq_id),
    .first_in_chain(first_in_chain[2:0]), .psi_mode(b_data_mode_sel), .reset(readout_reset),
    .psi_dig_sdata_clk(psi_dig_sdata_clk), .psi_dig_data_delayed(psi_dig_data_delayed),
    .psi_token_in(psi_token_in), .psi_token_out(delayed_token), .tokin_cnt(event_number[59:0]),
    .token_stack_count(token_count), .time_stamp(timestamp), .trig_cnt(trigger_number[19:0]),
    .cal_tag_trig_num_sel(cal_tag_trig_num_sel), .cal_tag(cal_tag), .bus_dout(psi_burst_data),
    .ovf_err(psi_errors[2:0]), .rd_token_out(token[3:1]), .we_out(psi_b_data_we_pre_and),
    .error_decoder_ovf(psi_errors[6:4]), .error_reset_req(psi_dig_reset_req), .sm_ready(psi_dig_sm_ready));
  assign psi_b_data_we[1:0] = psi_dig_ctrl[7:6] & psi_b_data_we_pre_and[1:0];  // and2 WE_DIG_AND[1..0], 2 bits wide
  assign XLXN_18546 = psi_dig_ctrl[3:2] & psi_dig_reset_req[1:0];  // and2 RESET_REQ_AND[1..0], 2 bits wide
  assign XLXN_18540 = psi_dig_ctrl[5:4] | psi_dig_sm_ready[1:0];  // or2 SM_READY_OR[1..0], 2 bits wide
  dcm_base #(.CLKIN_PERIOD(16), .CLKFX_MULTIPLY(4), .CLKFX_DIVIDE(4), .DCM_PERFORMANCE_MODE("MAX_SPEED"), .CLKIN_DIVIDE_BY_2("FALSE"), .CLK_FEEDBACK("1X")) XLXI_6096 (
    .CLKIN(ACC_CLK_IN), .CLKFB(XLXN_18390), .RST(reset_dig4x_dcm), .CLK0(XLXN_18389), .CLK2X(XLXN_18354),
    .CLK2X180(XLXN_18569), .LOCKED(psi_status[8]));  // open: CLK90, CLK180, CLK270, CLKDV, CLKFX, CLKFX180
  bufg XLXI_6083 (.I(XLXN_18354), .O(internal_4x_clk));
  bufg XLXI_6098 (.I(XLXN_18389), .O(XLXN_18390));
  ibufds #(.DIFF_TERM("TRUE")) XLXI_4794 (.I(BUSD_24DP_48S), .IB(BUSD_24DN_49S), .O(EXT_TRIGG));
  ibufgds #(.DIFF_TERM("TRUE")) XLXI_5567 (.I(BUSD_15DP_30S), .IB(BUSD_15DN_31S), .O(EXT_CLK));
  obufds XLXI_4831 (.I(EXT_TRIGG), .O(BUSD_26DP_52S), .OB(BUSD_26DN_53S));
  obufds XLXI_4832 (.I(EXT_CLK), .O(BUSB_15DP_30S), .OB(BUSB_15DN_31S));
  obufds XLXI_4830 (.I(EXT_CLK), .O(BUSD_25DP_50S), .OB(BUSD_25DN_51S));
  obufds XLXI_4833 (.I(EXT_TRIGG), .O(BUSB_24DP_48S), .OB(BUSB_24DN_49S));
  obufds XLXI_6046 (.I(EXT_CLK), .O(BUSB_13DP_26S), .OB(BUSB_13DN_27S));
  obufds XLXI_6047 (.I(EXT_TRIGG), .O(BUSB_14DP_28S), .OB(BUSB_14DN_29S));
  bufg XLXI_6147 (.I(dut_src_clk), .O(dut_src_clk_bufg));
  ftc XLXI_4846 (.C(internal_acc_clk), .CLR(1'b0), .T(1'b1), .Q(XLXN_18532));
  m2_1 XLXI_4773 (.D0(XLXN_18532), .D1(EXT_CLK), .S0(adc_clk_sel), .O(dut_src_clk));
  bufg XLXI_4844 (.I(XLXN_18537), .O(ACC_CLK_IN));
  ibufds #(.DIFF_TERM("TRUE")) XLXI_6040 (.I(BUSB_18DP_36S), .IB(BUSB_18DN_37S), .O(psi_dig_data[0]));
  ibufds #(.DIFF_TERM("FALSE")) XLXI_6051 (.I(BUSAA_06DP_12S), .IB(BUSAA_06DN_13S), .O(psi_dig_data[1]));
  iobuf XLXI_4171 (.I(XLXN_12023), .IO(BUSC_21DN_43S), .O(reset_button), .T(XLXN_12023));
  not XLXI_3360 (XLXN_12023, reset_phy);
  ibuf XLXI_6157 (.I(IP_MAC_4), .O(gec_user_addrs[4]));
  ibuf XLXI_6158 (.I(IP_MAC_5), .O(gec_user_addrs[5]));
  ibuf XLXI_6159 (.I(IP_MAC_3), .O(gec_user_addrs[3]));
  ibuf XLXI_6169 (.I(IP_MAC_6), .O(gec_user_addrs[6]));
  ibuf XLXI_6170 (.I(IP_MAC_7), .O(gec_user_addrs[7]));
  fde sm_ready_ff[1:0] (.C(MASTER_CLK), .CE(1'b1), .D(XLXN_18540), .Q(sm_ready[1:0]));
  fde error_reset_ff[1:0] (.C(MASTER_CLK), .CE(1'b1), .D(XLXN_18546), .Q(error_reset_req[1:0]));
  bufg XLXI_6183 (.I(XLXN_18569), .O(internal_4x180_clk));
  ibufds #(.DIFF_TERM("TRUE")) XLXI_6184 (.I(GENERAL_20DP_40S), .IB(GENERAL_20DN_41S), .O(psi_token_out[2]));
  obufds XLXI_6185 (.I(dut_dcm_clk90[2]), .O(BUSC_11DP_22S), .OB(BUSC_11DN_23S));
  obufds XLXI_6186 (.I(psi_data_out[2]), .O(BUSC_04DP_08S), .OB(BUSC_04DN_09S));
  obuf XLXI_6188 (.I(XLXN_18989), .O(BUSC_02DP_04S));
  obufds XLXI_6189 (.I(psi_trigger_mux[2]), .O(BUSC_03DP_06S), .OB(BUSC_03DN_07S));
  ibufds #(.DIFF_TERM("FALSE")) XLXI_6191 (.I(BUSC_06DP_12S), .IB(BUSC_06DN_13S), .O(psi_dig_data[2]));
  m2_1 XLXI_6067 (.D0(internal_4x_clk), .D1(internal_4x180_clk), .S0(psi_dig_ctrl[0]), .O(XLXN_18355));
  bufg XLXI_6072 (.I(XLXN_18355), .O(psi_dig_sdata_clk[0]));
  bufg XLXI_6087 (.I(XLXN_18372), .O(psi_dig_sdata_clk[1]));
  m2_1 XLXI_6086 (.D0(internal_4x_clk), .D1(internal_4x180_clk), .S0(psi_dig_ctrl[1]), .O(XLXN_18372));
  bufg XLXI_6192 (.I(XLXN_18597), .O(psi_dig_sdata_clk[2]));
  m2_1 XLXI_6193 (.D0(internal_4x_clk), .D1(internal_4x180_clk), .S0(third_dut_ctrl[4]), .O(XLXN_18597));
  fd8ce XLXI_6084 (.C(MASTER_CLK), .CE(PSI_DIG_MAP), .CLR(1'b0), .D(rx_data[7:0]), .Q(psi_dig_ctrl));
  fde XLXI_6206 (.C(MASTER_CLK), .CE(PSI_DIG_MAP), .D(rx_data[16]), .Q(reset_dig4x_dcm));
  fd8ce XLXI_6207 (.C(MASTER_CLK), .CE(PSI_DIG_MAP), .CLR(1'b0), .D(rx_data[15:8]), .Q(third_dut_ctrl));
  and XLXI_6216 (psi_b_data_we[2], third_dut_ctrl[2], psi_b_data_we_pre_and[2]);
  and XLXI_6217 (XLXN_18694, third_dut_ctrl[0], psi_dig_reset_req[2]);
  or XLXI_6218 (XLXN_18695, third_dut_ctrl[1], psi_dig_sm_ready[2]);
  fde XLXI_6220 (.C(MASTER_CLK), .CE(1'b1), .D(XLXN_18695), .Q(sm_ready[2]));
  fde XLXI_6221 (.C(MASTER_CLK), .CE(1'b1), .D(XLXN_18694), .Q(error_reset_req[2]));
  or XLXI_6227 (psi_burst_we, psi_b_data_we[2], psi_b_data_we[1], psi_b_data_we[0]);
  obuf XLXI_6228 (.I(psi_token_in_mux[2]), .O(GENERAL_19DP_38S));
  not XLXI_6229 (XLXN_18698, psi_token_in_mux[2]);
  obuf XLXI_6230 (.I(XLXN_18698), .O(GENERAL_19DN_39S));
  fd8ce XLXI_6315 (.C(MASTER_CLK), .CE(PSI_PHASE_FLIP_MAP), .CLR(1'b0), .D(rx_data[7:0]), .Q(dut_phase_ctrl[7:0]));
  bufg XLXI_6320[2:0] (.I(XLXN_18857), .O(dut_dcm_clk90));
  psi_cmd_fifo32_512depth psi_cmd_fifo_vector[2:0] (
    .rst(psi_reset), .wr_clk(MASTER_CLK), .rd_clk(psi_i2c_clk), .wr_en(PSI_CMD_FIFO_MAP),
    .rd_en(psi_cmd_fifo_re), .din(rx_data[31:0]), .full(psi_cmd_fifo_full), .empty(psi_cmd_fifo_empty),
    .dout(psi_cmd_fifo_dout));
  psi_command_sender psi_cmd_sender_vector[2:0] (
    .psi_clk(psi_i2c_clk), .reset(psi_reset), .fifo_empty(psi_cmd_fifo_empty), .fifo_full(psi_cmd_fifo_full),
    .data(psi_cmd_fifo_dout), .fifo_re(psi_cmd_fifo_re), .data_error(psi_errors[34:32]),
    .we_error(psi_errors[38:36]), .data_out(psi_cmd_sender_dout));
  d2_4e XLXI_6323 (
    .A0(global_plaq_write_sel[0]), .A1(global_plaq_write_sel[1]), .E(psi_cmd_sender_dout[0]),
    .D0(psi_data_out[0]));  // open: D1, D2, D3
  d2_4e XLXI_6260 (
    .A0(global_plaq_write_sel[0]), .A1(global_plaq_write_sel[1]), .E(psi_cmd_sender_dout[1]),
    .D1(psi_data_out[1]));  // open: D0, D2, D3
  d2_4e XLXI_5284 (
    .A0(global_plaq_write_sel[0]), .A1(global_plaq_write_sel[1]), .E(psi_cmd_sender_dout[2]),
    .D2(psi_data_out[2]));  // open: D0, D1, D3
  and XLXI_5976 (XLXN_18983, inv_psi_reset, psi_token_reset_n[0]);
  and XLXI_5977 (XLXN_18986, inv_psi_reset, psi_token_reset_n[1]);
  and XLXI_6190 (XLXN_18989, inv_psi_reset, psi_token_reset_n[2]);
  bufg XLXI_6342 (.I(XLXN_18993), .O(PSI_CLK90));
  bufg XLXI_6343 (.I(XLXN_18992), .O(PSI_CLK270));
  fd8ce XLXI_6345 (
    .C(MASTER_CLK), .CE(PSI_PHASE_TOK_TRIG_MAP), .CLR(1'b0), .D(rx_data[15:8]), .Q(dut_phase_ctrl[15:8]));
  m2_1 XLXI_6340 (.D0(psi_token_in[0]), .D1(psi180_token_in[0]), .S0(dut_phase_ctrl[8]), .O(psi_token_in_mux[0]));
  m2_1 XLXI_6341 (.D0(psi_trigger), .D1(psi180_trigger), .S0(dut_phase_ctrl[9]), .O(psi_trigger_mux[0]));
  fd XLXI_6352 (.C(PSI_CLK270), .D(psi_trigger), .Q(psi180_trigger));
  m2_1 XLXI_6356 (.D0(psi_token_in[1]), .D1(psi180_token_in[1]), .S0(dut_phase_ctrl[10]), .O(psi_token_in_mux[1]));
  m2_1 XLXI_6357 (.D0(psi_trigger), .D1(psi180_trigger), .S0(dut_phase_ctrl[11]), .O(psi_trigger_mux[1]));
  fd XLXI_6346 (.C(PSI_CLK270), .D(psi_token_in[0]), .Q(psi180_token_in[0]));
  fd XLXI_6359 (.C(PSI_CLK270), .D(psi_token_in[1]), .Q(psi180_token_in[1]));
  m2_1 XLXI_6360 (.D0(psi_token_in[2]), .D1(psi180_token_in[2]), .S0(dut_phase_ctrl[12]), .O(psi_token_in_mux[2]));
  m2_1 XLXI_6361 (.D0(psi_trigger), .D1(psi180_trigger), .S0(dut_phase_ctrl[13]), .O(psi_trigger_mux[2]));
  fd XLXI_6362 (.C(PSI_CLK270), .D(psi_token_in[2]), .Q(psi180_token_in[2]));
  or XLXI_6363 (XLXN_18810, psi_cmd_fifo_empty[2], psi_cmd_fifo_empty[1], psi_cmd_fifo_empty[0]);
  dcm_ps #(.CLKIN_PERIOD(26), .DCM_PERFORMANCE_MODE("MAX_RANGE"), .CLKFX_MULTIPLY(2), .CLKFX_DIVIDE(2), .CLKOUT_PHASE_SHIFT("VARIABLE_CENTER")) dut_clk_dcm[2:0] (
    .CLKIN(dut_src_clk_bufg), .CLKFB(dut_dcm_clk0), .RST(dut_phase_ctrl[6:4]), .PSINCDEC(dut_phase_ctrl[0]),
    .PSEN(dut_ps_en), .PSCLK(MASTER_CLK), .CLK0(XLXN_18856), .CLK90(XLXN_18857), .LOCKED(psi_status[3:1]));  // open: CLK180, CLK270, CLK2X, CLK2X180, CLKDV, CLKFX, CLKFX180, PSDONE, DO
  bufg XLXI_6319[2:0] (.I(XLXN_18856), .O(dut_dcm_clk0));
  obufds XLXI_6364 (.I(EXT_CLK), .O(BUSD_21DP_42S), .OB(BUSD_21DN_43S));
  obufds XLXI_6365 (.I(EXT_TRIGG), .O(BUSD_18DP_36S), .OB(BUSD_18DN_37S));
  fde XLXI_6366 (.C(MASTER_CLK), .CE(1'b1), .D(XLXN_19008), .Q(psi_dig_data_delay_inc));
  fde XLXI_6367 (.C(MASTER_CLK), .CE(1'b1), .D(XLXN_19009), .Q(psi_dig_data_delay_rst));
  fde XLXI_6370 (.C(MASTER_CLK), .CE(1'b1), .D(XLXN_19019), .Q(dut_ps_en[0]));
  fde XLXI_6372 (.C(MASTER_CLK), .CE(1'b1), .D(XLXN_19020), .Q(dut_ps_en[1]));
  fde XLXI_6374 (.C(MASTER_CLK), .CE(1'b1), .D(XLXN_19021), .Q(dut_ps_en[2]));
  m4_1e psi_cmd_clk_mux[2:0] (
    .D0(dut_dcm_clk0), .D1(dut_dcm_clk90), .D2(dut_dcm_clk0_inv), .D3(dut_dcm_clk90_inv), .E(1'b1),
    .S0(psi_out_clk_sel[2:0]), .S1(psi_out_clk_sel[5:3]), .O(XLXN_19101));
  bufg psi_cmd_clk_bufg[2:0] (.I(XLXN_19101), .O(psi_i2c_clk));
  assign dut_dcm_clk0_inv = ~dut_dcm_clk0;  // inv psi_cmd_inv0[2..0], 3 bits wide
  assign dut_dcm_clk90_inv = ~dut_dcm_clk90;  // inv psi_cmd_inv1[2..0], 3 bits wide
  fd8re XLXI_6104 (.C(MASTER_CLK), .CE(PSI_OUT_CLK_SELECT_MAP), .D(rx_data[7:0]), .R(reset), .Q(psi_out_clk_sel));

  // Notes on the sheet:
  //   GEC_CONTROLLER
  //   RESET MANAGER
  //   GEC_IO
  //   MASTER_CLK is GMII_RX_CLK
  //   Dont use D4!.. In use by master for trigger. Avoid accidental tampering.
  //   READ MUX
  //   0 - is Plaq0, 1 - is Plaq1, 2 - is Plaq2, 3 - is Plaq3
  //   0 - is ADC mode, 1 - is PSI mode
  //   Bits 3,4 select PSI decoder debug mode. 00 is normal pixel data mode.
  //   PSI CONTROLLER
  //   CLK and PSI RESETS
  //   FOR INPUT DELAY LINES
  //   CLOCK GENERATION
  //   Foundation I/O
  //   Digital PSI46 I/O - Plaquette 0
  //   Digital PSI46 I/O - Plaquette 1
  //   Digital PSI46 I/O - Plaquette 2
  //   EXTERNAL TRIGGER AND CLOCK INPUT/OUTPUT
  //   STIB J1 - Top Left (Trig P1, Clk P2)
  //   STIB J2 - Bottom Left (Trig P1, Clk P2)
  //   STIB J27 - Top Right (Trig P1, Clk P2)
  //   STIB J18 - Bottom Right (Trig P1, Clk P2)
  //   STIB J18 - Bottom Right (Trig P1, Clk P2)
endmodule
